# Altium project POEInjector.PrjPcb
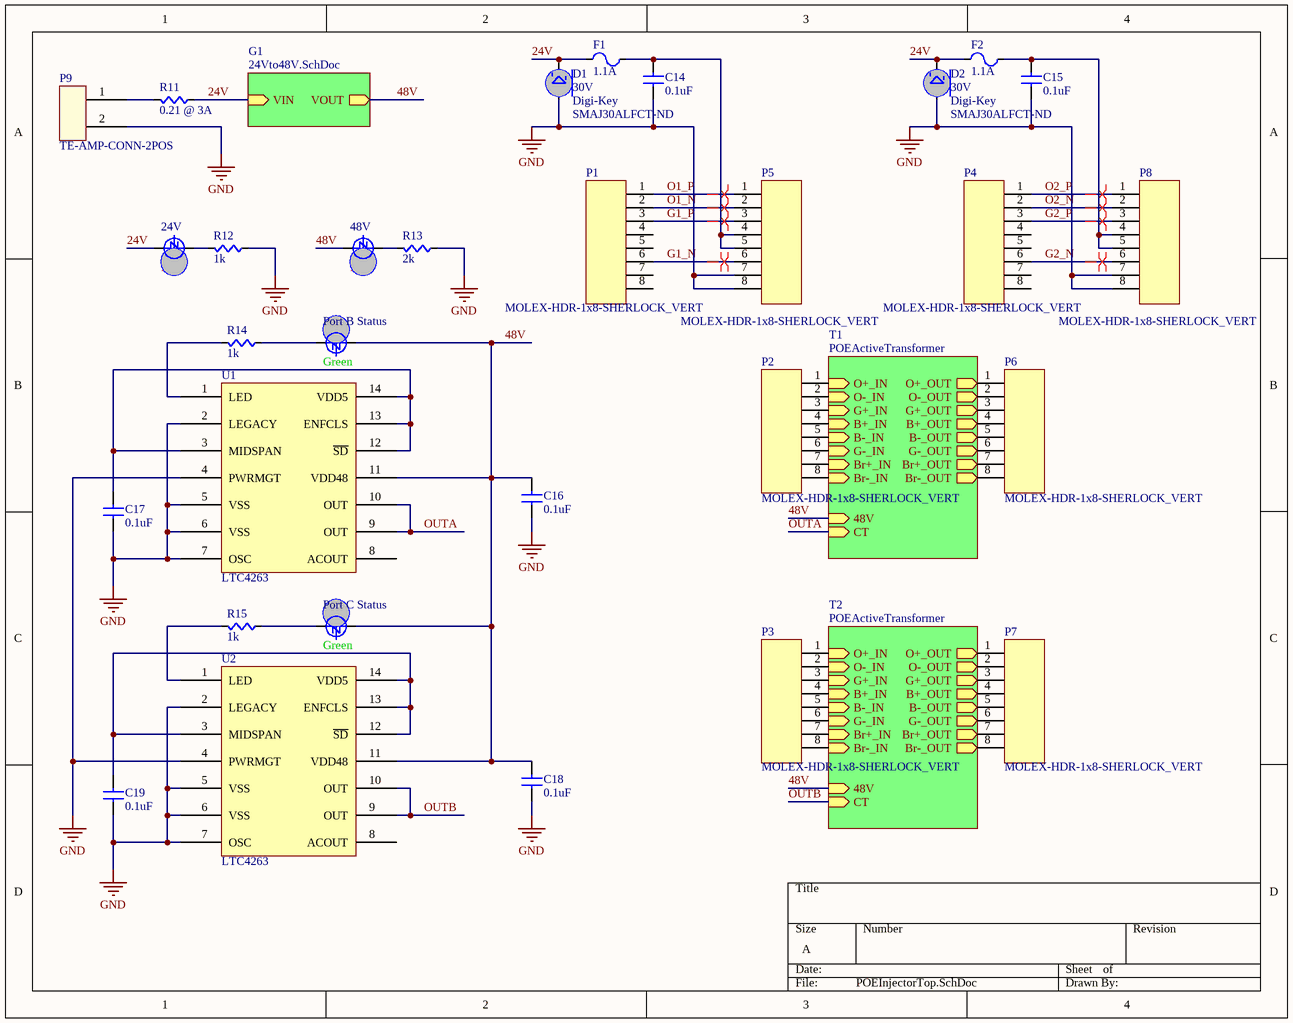
[diagram p0: POEInjectorTop.SchDoc]
3 sheets, 65 parts. Net scope: hierarchical (ports join the sheet entries above them; power ports are global).
Board file: POEInjector.PcbDoc
Sheets:
  POEInjectorTop.SchDoc
    G1 = 24Vto48V.SchDoc
    T1 = POEActiveTransformer.SchDoc
    T2 = POEActiveTransformer.SchDoc

## Sheet POEInjectorTop.SchDoc
size A

### Parts
24V  Color: Red  [LED0603]  (hidden comment: LED)
48V  Color: Red  [LED0603]  (hidden comment: LED)
C14  value 0.1uF  [CAPC0603]  (hidden comment: Cap)
C15  value 0.1uF  [CAPC0603]  (hidden comment: Cap)
C16  value 0.1uF  [CAPC0603]  (hidden comment: Cap)
C17  value 0.1uF  [CAPC0603]  (hidden comment: Cap)
C18  value 0.1uF  [CAPC0603]  (hidden comment: Cap)
C19  value 0.1uF  [CAPC0603]  (hidden comment: Cap)
D1  value 30V  Supplier 1: Digi-Key  Supplier Part Number 1: SMAJ30ALFCT-ND  [SMASeries]  (hidden comment: Zener)
D2  value 30V  Supplier 1: Digi-Key  Supplier Part Number 1: SMAJ30ALFCT-ND  [SMASeries]  (hidden comment: Zener)
F1  value 1.1A  [PTC7451X11N]  (hidden comment: PTC Fuse)
F2  value 1.1A  [PTC7451X11N]  (hidden comment: PTC Fuse)
P1  MOLEX-HDR-1x8-SHERLOCK_VERT  [MOLEX-HDR-1X8-SHERLOCK-VERT]
P2  MOLEX-HDR-1x8-SHERLOCK_VERT  [MOLEX-HDR-1X8-SHERLOCK-VERT]
P3  MOLEX-HDR-1x8-SHERLOCK_VERT  [MOLEX-HDR-1X8-SHERLOCK-VERT]
P4  MOLEX-HDR-1x8-SHERLOCK_VERT  [MOLEX-HDR-1X8-SHERLOCK-VERT]
P5  MOLEX-HDR-1x8-SHERLOCK_VERT  [MOLEX-HDR-1X8-SHERLOCK-VERT]
P6  MOLEX-HDR-1x8-SHERLOCK_VERT  [MOLEX-HDR-1X8-SHERLOCK-VERT]
P7  MOLEX-HDR-1x8-SHERLOCK_VERT  [MOLEX-HDR-1X8-SHERLOCK-VERT]
P8  MOLEX-HDR-1x8-SHERLOCK_VERT  [MOLEX-HDR-1X8-SHERLOCK-VERT]
P9  TE-AMP-CONN-2POS  [TE AMP CONN 2POS]
Port_B_Status  Color: Green  [LED0603]  (hidden comment: LED)
Port_C_Status  Color: Green  [LED0603]  (hidden comment: LED)
R11  value 0.21 @ 3A  [AXIAL-0.3]  (hidden comment: Res)
R12  value 1k  [RES0603]  (hidden comment: Res)
R13  value 2k  [RES0603]  (hidden comment: Res)
R14  value 1k  [RES0603]  (hidden comment: Res)
R15  value 1k  [RES0603]  (hidden comment: Res)
U1  LTC4263  [LTC4263]
U2  LTC4263  [LTC4263]

### Sub-sheets
G1 = 24Vto48V.SchDoc: VIN (in), VOUT (out)
T1 = POEActiveTransformer: O+_IN, O-_IN, G+_IN, B+_IN, B-_IN, G-_IN, Br+_IN, Br-_IN, O+_OUT, O-_OUT, G+_OUT, B+_OUT, B-_OUT, G-_OUT, Br+_OUT, Br-_OUT, 48V, CT
T2 = POEActiveTransformer: O+_IN, O-_IN, G+_IN, B+_IN, B-_IN, G-_IN, Br+_IN, Br-_IN, O+_OUT, O-_OUT, G+_OUT, B+_OUT, B-_OUT, G-_OUT, Br+_OUT, Br-_OUT, 48V, CT

### Nets
GND: C14.2(B) C15.2(B) C16.2(B) C17.2(B) C18.2(B) C19.2(B) D1.A D2.A P5.7 P5.8 P8.7 P8.8 P9.2 R12.2(B) R13.2(B) U1.2(LEGACY) U1.4(PWRMGT) U1.5(VSS) U1.6(VSS) U1.7(OSC) U2.2(LEGACY) U2.4(PWRMGT) U2.5(VSS) U2.6(VSS) U2.7(OSC)
24V: 24V.A D1.C D2.C F1.1(A) F2.1(A) R11.2(B) ; sheet G1/VIN
48V: 48V.A C16.1(A) C18.1(A) Port_B_Status.A Port_C_Status.A U1.11(VDD48) U2.11(VDD48) ; sheet G1/VOUT, sheet T1/48V, sheet T2/48V
B_IN_N: P2.5 ; sheet T1/B-_IN
B_IN_N: P3.5 ; sheet T2/B-_IN  [a separate net that carries the same name]
B_IN_P: P2.4 ; sheet T1/B+_IN
B_IN_P: P3.4 ; sheet T2/B+_IN  [a separate net that carries the same name]
B_OUT_N: P6.5 ; sheet T1/B-_OUT
B_OUT_N: P7.5 ; sheet T2/B-_OUT  [a separate net that carries the same name]
B_OUT_P: P6.4 ; sheet T1/B+_OUT
B_OUT_P: P7.4 ; sheet T2/B+_OUT  [a separate net that carries the same name]
Br_IN_N: P2.8 ; sheet T1/Br-_IN
Br_IN_N: P3.8 ; sheet T2/Br-_IN  [a separate net that carries the same name]
Br_IN_P: P2.7 ; sheet T1/Br+_IN
Br_IN_P: P3.7 ; sheet T2/Br+_IN  [a separate net that carries the same name]
Br_OUT_N: P6.8 ; sheet T1/Br-_OUT
Br_OUT_N: P7.8 ; sheet T2/Br-_OUT  [a separate net that carries the same name]
Br_OUT_P: P6.7 ; sheet T1/Br+_OUT
Br_OUT_P: P7.7 ; sheet T2/Br+_OUT  [a separate net that carries the same name]
G1_N: P1.6 P5.6
G1_P: P1.3 P5.3
G2_N: P4.6 P8.6
G2_P: P4.3 P8.3
G_IN_N: P2.6 ; sheet T1/G-_IN
G_IN_N: P3.6 ; sheet T2/G-_IN  [a separate net that carries the same name]
G_IN_P: P2.3 ; sheet T1/G+_IN
G_IN_P: P3.3 ; sheet T2/G+_IN  [a separate net that carries the same name]
G_OUT_N: P6.6 ; sheet T1/G-_OUT
G_OUT_N: P7.6 ; sheet T2/G-_OUT  [a separate net that carries the same name]
G_OUT_P: P6.3 ; sheet T1/G+_OUT
G_OUT_P: P7.3 ; sheet T2/G+_OUT  [a separate net that carries the same name]
O1_N: P1.2 P5.2
O1_P: P1.1 P5.1
O2_N: P4.2 P8.2
O2_P: P4.1 P8.1
O_IN_N: P2.2 ; sheet T1/O-_IN
O_IN_N: P3.2 ; sheet T2/O-_IN  [a separate net that carries the same name]
O_IN_P: P2.1 ; sheet T1/O+_IN
O_IN_P: P3.1 ; sheet T2/O+_IN  [a separate net that carries the same name]
O_OUT_N: P6.2 ; sheet T1/O-_OUT
O_OUT_N: P7.2 ; sheet T2/O-_OUT  [a separate net that carries the same name]
O_OUT_P: P6.1 ; sheet T1/O+_OUT
O_OUT_P: P7.1 ; sheet T2/O+_OUT  [a separate net that carries the same name]
OUTA: U1.9(OUT) U1.10(OUT) ; sheet T1/CT
OUTB: U2.9(OUT) U2.10(OUT) ; sheet T2/CT  [project net OUTA]
Net24V_C: 24V.C R12.1(A)
Net48V_C: 48V.C R13.1(A)
NetC14_1: C14.1(A) F1.2(B) P5.4 P5.5
NetC15_1: C15.1(A) F2.2(B) P8.4 P8.5
NetC17_1: C17.1(A) U1.3(MIDSPAN) U1.12(~{SD}) U1.13(ENFCLS) U1.14(VDD5)
NetC19_1: C19.1(A) U2.3(MIDSPAN) U2.12(~{SD}) U2.13(ENFCLS) U2.14(VDD5)
NetP9_1: P9.1 R11.1(A)
NetPort_B_Status_C: Port_B_Status.C R14.2(B)
NetPort_C_Status_C: Port_C_Status.C R15.2(B)
NetR14_1: R14.1(A) U1.1(LED)
NetR15_1: R15.1(A) U2.1(LED)

Not connected (* = marked no-connect by the designer): P1 4 5 7 8; P4 4 5 7 8; U1 8(ACOUT); U2 8(ACOUT)

### Layout directives
differential pair: G1_N, G1_P, G2_N, G2_P, O1_N, O1_P, O2_N, O2_P

### Library data of the parts
D1 D2 = Zener: Zener Diode
F1 F2 = PTC_Fuse: Supplier 1: Digi-Key; Supplier Part Number 1: 507-1744-1-ND
P1-P8 = MOLEX-HDR-1x8-SHERLOCK_VERT: CONN HEADER 8POS 2MM VERT TIN; Supplier 1: Digi-Key; Supplier Part Number 1: WM18926-ND
P9 = TE-AMP-CONN-2POS: 2 Positions Header Connector 0.156" (3.96mm) Through Hole Tin; Supplier 1: Digi-Key; Supplier Part Number 1: A99845-ND; Mating Conn. Digi-Key P/N: A103948-ND
U1 U2 = LTC4263: IC POE 803.2AF SINGL PSE 14-SOIC; Supplier 1: Digi-Key; Supplier Part Number 1: LTC4263CS#PBF-ND
24V 48V Port_B_Status Port_C_Status = LED: Supplier 1: Digi-Key
  24V 48V: Supplier Part Number 1: 754-1122-1-ND
  Port_B_Status Port_C_Status: Supplier Part Number 1: 754-1121-1-ND
C14-C19 = Cap: Supplier 1: Digi-Key
  C14-C16 C18: Supplier Part Number 1: 1276-6807-1-ND
  C17 C19: Supplier Part Number 1: 1276-1000-1-ND
R11-R15 = Res: Supplier 1: Digi-Key
  R11: Supplier Part Number 1: 311-10.0HRCT-ND
  R12 R14 R15: Supplier Part Number 1: RMCF0603JJ1K00CT-ND
  R13: Supplier Part Number 1: RMCF0603JT2K00CT-ND

## Sheet 24Vto48V.SchDoc
size A
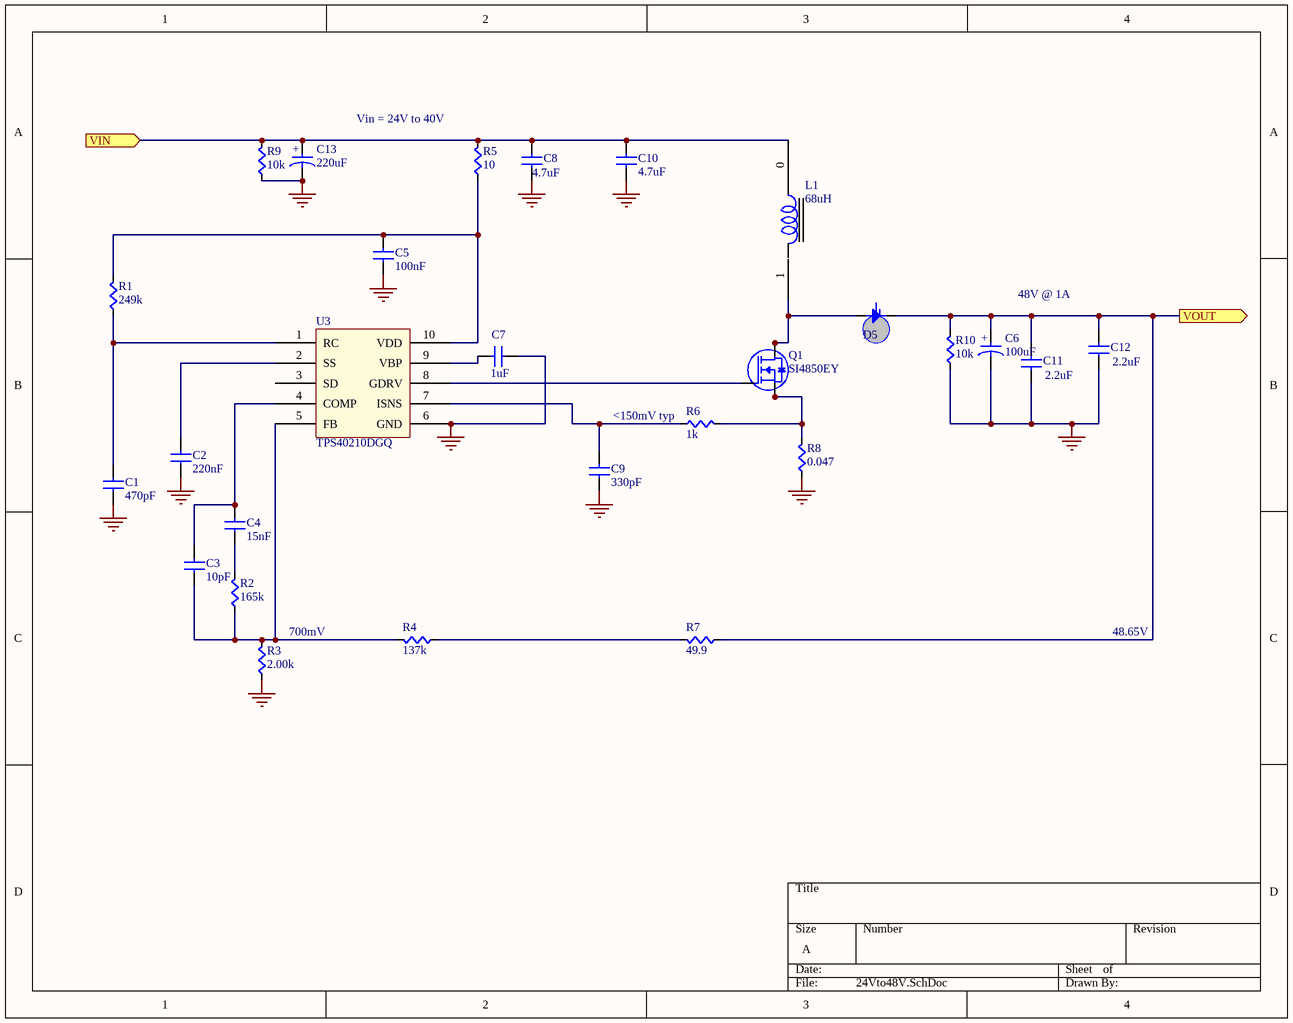
[diagram p1: 24Vto48V.SchDoc]

### Parts
C1  value 470pF  [CAPC0603]  (hidden comment: Cap)
C2  value 220nF  [CAPC0603]  (hidden comment: Cap)
C3  value 10pF  [CAPC0603]  (hidden comment: Cap)
C4  value 15nF  [CAPC0603]  (hidden comment: Cap)
C5  value 100nF  [CAPC0603]  (hidden comment: Cap)
C6  value 100uF  [PCE3917CT-ND]  (hidden comment: Cap Tant)
C7  value 1uF  [CAPC0603]  (hidden comment: Cap)
C8  value 4.7uF  [CAP1210]  (hidden comment: CAP1210)
C9  value 330pF  [CAPC0603]  (hidden comment: Cap)
C10  value 4.7uF  [CAP1210]  (hidden comment: CAP1210)
C11  value 2.2uF  [CAP1210]  (hidden comment: CAP1210)
C12  value 2.2uF  [CAP1210]  (hidden comment: CAP1210)
C13  value 220uF  [PCE3921CT-ND]  (hidden comment: Cap Tant)
D5  Diode  [MBRS360SMB]  (value not drawn)
L1  value 68uH  [732-1247-1-ND]  (hidden comment: 37392C)
Q1  SI4850EY  [SOIC-8-NO-EP]
R1  value 249k  [RES0603]  (hidden comment: Res)
R2  value 165k  [RES0603]  (hidden comment: Res)
R3  value 2.00k  [RES0603]  (hidden comment: Res)
R4  value 137k  [RES0603]  (hidden comment: Res)
R5  value 10  [RES0603]  (hidden comment: Res)
R6  value 1k  [RES0603]  (hidden comment: Res)
R7  value 49.9  [RES0603]  (hidden comment: Res)
R8  value 0.047  [RES2512]  (hidden comment: Res)
R9  value 10k  [RES0603]  (hidden comment: Res)
R10  value 10k  [RES0603]  (hidden comment: Res)
U3  TPS40210DGQ  [TPS40210]

### Ports
VIN (in), VOUT (out)

### Nets
GND: C1.2(B) C2.2(B) C5.2(B) C6.2(B) C7.2(B) C8.2(B) C9.2(B) C10.2(B) C11.2(B) C12.2(B) C13.2(B) R3.2(B) R8.2(B) R9.2(B) R10.2(B) U3.6(GND)
24V: C8.1(A) C10.1(A) C13.1(A) L1.0 R5.1(A) R9.1(A) ; port VIN
48V: C6.1(A) C11.1(A) C12.1(A) D5.C R7.2(B) R10.1(A) ; port VOUT
NetC1_1: C1.1(A) R1.2(B) U3.1(RC)
NetC2_1: C2.1(A) U3.2(SS)
NetC3_1: C3.1(A) C4.1(A) U3.4(COMP)
NetC3_2: C3.2(B) R2.2(B) R3.1(A) R4.1(A) U3.5(FB)
NetC4_2: C4.2(B) R2.1(A)
NetC5_1: C5.1(A) R1.1(A) R5.2(B) U3.10(VDD)
NetC7_1: C7.1(A) U3.9(VBP)
NetC9_1: C9.1(A) R6.2(B) U3.7(ISNS)
NetD5_A: D5.A L1.1 Q1.5(D) Q1.6(D) Q1.7(D) Q1.8(D)
NetQ1_1: Q1.1(S) Q1.2(S) Q1.3(S) R6.1(A) R8.1(A)
NetQ1_4: Q1.4(G) U3.8(GDRV)
NetR4_2: R4.2(B) R7.1(A)

Not connected (* = marked no-connect by the designer): U3 3(SD)

### Notes on the sheet
- (near R5) Vin = 24V to 40V
- 48V @ 1A
- (near R6) <150mV typ
- (near R3) 700mV
- 48.65V
- (in symbol CapPol) +

### Library data of the parts
C6 = CapPol: CAP ALUM 100UF 20% 50V SMD; Supplier 1: Digi-Key; Supplier Part Number 1: PCE3917CT-ND
C8 C10-C12 = CAP1210: CAP CER 10UF 50V 20% X5R 1210; Supplier 1: Digi-Key
  C8 C10: Supplier Part Number 1: 1276-1292-1-ND
  C11 C12: Supplier Part Number 1: 445-4498-1-ND
C13 = CapPol: CAP ALUM 220UF 20% 50V SMD; Supplier 1: Digi-Key; Supplier Part Number 1: 399-6123-ND
D5 = Diode: Standard Diode Template; Value: 60V 3A; Supplier Part Number 1: MBRS360BT3GOSCT-ND; Supplier: Digi-Key
L1 = 37392C: INDUCTOR 3.90UH 10.0A SMD; Supplier 1: Digi-Key; Supplier Part Number 1: 732-1247-1-ND
Q1 = SI4850EY: MOSFET N-CH 60V 6A 8-SOIC; Supplier 1: Digi-Key; Supplier Part Number 1: SI4850EY-T1-E3CT-ND
C1-C5 C7 C9 = Cap: Supplier 1: Digi-Key
  C1: Supplier Part Number 1: 399-7919-1-ND
  C2: Supplier Part Number 1: 445-1318-1-ND
  C3: Supplier Part Number 1: 490-3570-1-ND
  C4: Supplier Part Number 1: 1276-1967-1-ND
  C5: Supplier Part Number 1: 311-1343-1-ND
  C7: Supplier Part Number 1: 311-1446-1-ND
  C9: Supplier Part Number 1: 1276-6658-1-ND
R1-R10 = Res: Supplier 1: Digi-Key
  R1: Supplier Part Number 1: A102243CT-ND
  R2: Supplier Part Number 1: 311-165KHRCT-ND
  R3: Supplier Part Number 1: 311-2.00KHRCT-ND
  R4: Supplier Part Number 1: 311-137KHRCT-ND
  R5: Supplier Part Number 1: 311-10.0HRCT-ND
  R6: Supplier Part Number 1: A102226CT-ND
  R7: Supplier Part Number 1: A102283CT-ND
  R8: Supplier Part Number 1: P47TCT-ND
  R9 R10: Supplier Part Number 1: RMCF0603FT10K0CT-ND
U3 = TPS40210DGQ: Supplier Part Number 1: 296-26969-1-ND; Supplier 1: Digi-Key

## Sheet POEActiveTransformer.SchDoc
size A
Used 2 times, as channels T1, T2. Parts and nets are listed once, with the designators drawn on the sheet.
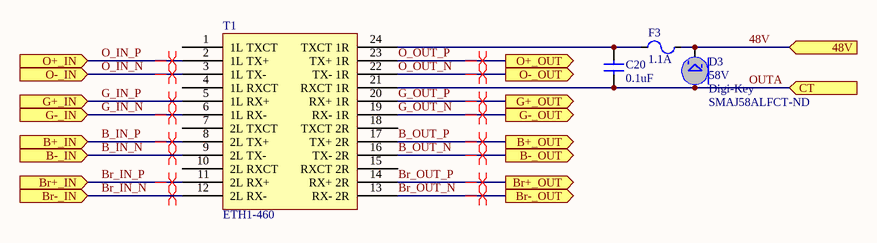
[diagram p2: POEActiveTransformer.SchDoc]

### Parts
C20  value 0.1uF  [CAPC0603]  (hidden comment: Cap)
D3  value 58V  Supplier 1: Digi-Key  Supplier Part Number 1: SMAJ58ALFCT-ND  [SMASeries]  (hidden comment: Zener)
F3  value 1.1A  [PTC7451X11N]  (hidden comment: PTC Fuse)
T1  ETH1-460  [ETH1-460]

### Ports
48V (in), B+_IN (in), B+_OUT (out), B-_IN (in), B-_OUT (out), Br+_IN (in), Br+_OUT (out), Br-_IN (in), Br-_OUT (out), CT (in), G+_IN (in), G+_OUT (out), G-_IN (in), G-_OUT (out), O+_IN (in), O+_OUT (out), O-_IN (in), O-_OUT (out)

### Nets
48V: D3.C F3.2(B) ; port 48V
B_IN_N: T1.9(2L_TX-) ; port B-_IN
B_IN_P: T1.8(2L_TX+) ; port B+_IN
B_OUT_N: T1.16(TX-_2R) ; port B-_OUT
B_OUT_P: T1.17(TX+_2R) ; port B+_OUT
Br_IN_N: T1.12(2L_RX-) ; port Br-_IN
Br_IN_P: T1.11(2L_RX+) ; port Br+_IN
Br_OUT_N: T1.13(RX-_2R) ; port Br-_OUT
Br_OUT_P: T1.14(RX+_2R) ; port Br+_OUT
G_IN_N: T1.6(1L_RX-) ; port G-_IN
G_IN_P: T1.5(1L_RX+) ; port G+_IN
G_OUT_N: T1.19(RX-_1R) ; port G-_OUT
G_OUT_P: T1.20(RX+_1R) ; port G+_OUT
O_IN_N: T1.3(1L_TX-) ; port O-_IN
O_IN_P: T1.2(1L_TX+) ; port O+_IN
O_OUT_N: T1.22(TX-_1R) ; port O-_OUT
O_OUT_P: T1.23(TX+_1R) ; port O+_OUT
OUTA: C20.2(B) D3.A T1.21(RXCT_1R) ; port CT
NetC20_1: C20.1(A) F3.1(A) T1.24(TXCT_1R)

Not connected (* = marked no-connect by the designer): T1 1(1L_TXCT) 4(1L_RXCT) 7(2L_TXCT) 10(2L_RXCT) 15(RXCT_2R) 18(TXCT_2R)

### Channels
T1: designators end in _T1; ports 48V=48V B+_IN=B_IN_P B+_OUT=B_OUT_P B-_IN=B_IN_N B-_OUT=B_OUT_N Br+_IN=Br_IN_P Br+_OUT=Br_OUT_P Br-_IN=Br_IN_N Br-_OUT=Br_OUT_N CT=OUTA G+_IN=G_IN_P G+_OUT=G_OUT_P G-_IN=G_IN_N G-_OUT=G_OUT_N O+_IN=O_IN_P O+_OUT=O_OUT_P O-_IN=O_IN_N O-_OUT=O_OUT_N
T2: designators end in _T2; ports 48V=48V B+_IN=B_IN_P B+_OUT=B_OUT_P B-_IN=B_IN_N B-_OUT=B_OUT_N Br+_IN=Br_IN_P Br+_OUT=Br_OUT_P Br-_IN=Br_IN_N Br-_OUT=Br_OUT_N CT=OUTA G+_IN=G_IN_P G+_OUT=G_OUT_P G-_IN=G_IN_N G-_OUT=G_OUT_N O+_IN=O_IN_P O+_OUT=O_OUT_P O-_IN=O_IN_N O-_OUT=O_OUT_N

### Layout directives
differential pair: B_IN_N, B_IN_P, B_OUT_N, B_OUT_P, Br_IN_N, Br_IN_P, Br_OUT_N, Br_OUT_P, G_IN_N, G_IN_P, G_OUT_N, G_OUT_P, O_IN_N, O_IN_P, O_OUT_N, O_OUT_P

### Library data of the parts
D3 = Zener: Zener Diode
F3 = PTC_Fuse: Supplier 1: Digi-Key; Supplier Part Number 1: 507-1744-1-ND
T1 = ETH1-460: "PoE Plus" Transformers Audio & Signal ETH1 60W 4pairs PoE+ Magnetic Module; Supplier 1: *; Supplier Part Number 1: *
C20 = Cap: Supplier 1: Digi-Key; Supplier Part Number 1: 1276-6807-1-ND

## Nets that join several sheets
GND: POEInjectorTop (25 pins), 24Vto48V (16 pins)
24V: POEInjectorTop (6 pins), 24Vto48V (6 pins)
48V: POEInjectorTop (7 pins), 24Vto48V (6 pins), T1 (D3_T1.C F3_T1.2), T2 (D3_T2.C F3_T2.2)
B_IN_N: POEInjectorTop (P2.5), T1 (T1_T1.9)
B_IN_N: POEInjectorTop (P3.5), T2 (T1_T2.9)
B_IN_P: POEInjectorTop (P2.4), T1 (T1_T1.8)
B_IN_P: POEInjectorTop (P3.4), T2 (T1_T2.8)
B_OUT_N: POEInjectorTop (P6.5), T1 (T1_T1.16)
B_OUT_N: POEInjectorTop (P7.5), T2 (T1_T2.16)
B_OUT_P: POEInjectorTop (P6.4), T1 (T1_T1.17)
B_OUT_P: POEInjectorTop (P7.4), T2 (T1_T2.17)
Br_IN_N: POEInjectorTop (P2.8), T1 (T1_T1.12)
Br_IN_N: POEInjectorTop (P3.8), T2 (T1_T2.12)
Br_IN_P: POEInjectorTop (P2.7), T1 (T1_T1.11)
Br_IN_P: POEInjectorTop (P3.7), T2 (T1_T2.11)
Br_OUT_N: POEInjectorTop (P6.8), T1 (T1_T1.13)
Br_OUT_N: POEInjectorTop (P7.8), T2 (T1_T2.13)
Br_OUT_P: POEInjectorTop (P6.7), T1 (T1_T1.14)
Br_OUT_P: POEInjectorTop (P7.7), T2 (T1_T2.14)
G_IN_N: POEInjectorTop (P2.6), T1 (T1_T1.6)
G_IN_N: POEInjectorTop (P3.6), T2 (T1_T2.6)
G_IN_P: POEInjectorTop (P2.3), T1 (T1_T1.5)
G_IN_P: POEInjectorTop (P3.3), T2 (T1_T2.5)
G_OUT_N: POEInjectorTop (P6.6), T1 (T1_T1.19)
G_OUT_N: POEInjectorTop (P7.6), T2 (T1_T2.19)
G_OUT_P: POEInjectorTop (P6.3), T1 (T1_T1.20)
G_OUT_P: POEInjectorTop (P7.3), T2 (T1_T2.20)
O_IN_N: POEInjectorTop (P2.2), T1 (T1_T1.3)
O_IN_N: POEInjectorTop (P3.2), T2 (T1_T2.3)
O_IN_P: POEInjectorTop (P2.1), T1 (T1_T1.2)
O_IN_P: POEInjectorTop (P3.1), T2 (T1_T2.2)
O_OUT_N: POEInjectorTop (P6.2), T1 (T1_T1.22)
O_OUT_N: POEInjectorTop (P7.2), T2 (T1_T2.22)
O_OUT_P: POEInjectorTop (P6.1), T1 (T1_T1.23)
O_OUT_P: POEInjectorTop (P7.1), T2 (T1_T2.23)
OUTA: POEInjectorTop (U1.9 U1.10), T1 (C20_T1.2 D3_T1.A T1_T1.21)
OUTA: POEInjectorTop (U2.9 U2.10), T2 (C20_T2.2 D3_T2.A T1_T2.21)